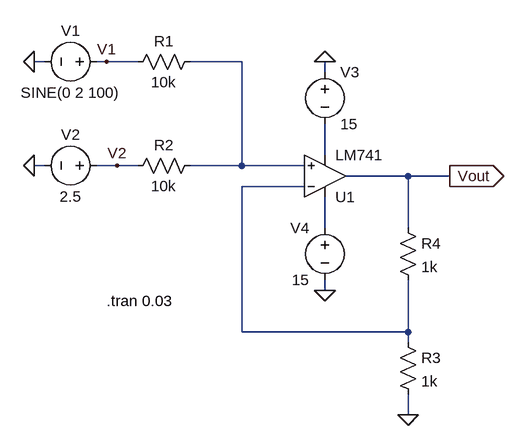
[diagram p0: schematic lab5_6b.asc]
lab5_6b.asc, the LTspice schematic file:
Version 4
SHEET 1 880 680
WIRE -224 -272 -240 -272
WIRE -128 -272 -144 -272
WIRE -80 -272 -128 -272
WIRE 80 -272 0 -272
WIRE 208 -256 208 -272
WIRE 208 -128 208 -176
WIRE -224 -112 -240 -112
WIRE -112 -112 -144 -112
WIRE -80 -112 -112 -112
WIRE 80 -112 80 -272
WIRE 80 -112 0 -112
WIRE 176 -112 80 -112
WIRE 336 -96 240 -96
WIRE 400 -96 336 -96
WIRE 176 -80 80 -80
WIRE 208 -16 208 -64
WIRE 336 -16 336 -96
WIRE 208 80 208 64
WIRE 80 144 80 -80
WIRE 336 144 336 64
WIRE 336 144 80 144
WIRE 336 160 336 144
WIRE 336 272 336 240
FLAG 208 80 0
FLAG 208 -272 0
FLAG -240 -272 0
FLAG -240 -112 0
FLAG 336 272 0
FLAG 400 -96 Vout
IOPIN 400 -96 Out
FLAG -128 -272 V1
FLAG -112 -112 V2
SYMBOL OpAmps\\LM741 208 -32 M180
SYMATTR InstName U1
SYMBOL res 16 -128 R90
WINDOW 0 0 56 VBottom 2
WINDOW 3 32 56 VTop 2
SYMATTR InstName R2
SYMATTR Value 10k
SYMBOL voltage -128 -272 R90
WINDOW 0 -32 56 VBottom 2
WINDOW 3 32 56 VTop 2
WINDOW 123 0 0 Left 0
WINDOW 39 -4 56 VBottom 2
SYMATTR InstName V1
SYMATTR Value SINE(0 2 100)
SYMBOL voltage -128 -112 R90
WINDOW 0 -32 56 VBottom 2
WINDOW 3 32 56 VTop 2
WINDOW 123 0 0 Left 0
WINDOW 39 0 0 Left 0
SYMATTR InstName V2
SYMATTR Value 2.5
SYMBOL voltage 208 -272 R0
WINDOW 123 0 0 Left 0
WINDOW 39 0 0 Left 0
SYMATTR InstName V3
SYMATTR Value 15
SYMBOL voltage 208 -32 M0
WINDOW 123 0 0 Left 0
WINDOW 39 0 0 Left 0
SYMATTR InstName V4
SYMATTR Value 15
SYMBOL res 320 -32 R0
SYMATTR InstName R4
SYMATTR Value 1k
SYMBOL res 320 144 R0
SYMATTR InstName R3
SYMATTR Value 1k
SYMBOL res 16 -288 R90
WINDOW 0 0 56 VBottom 2
WINDOW 3 32 56 VTop 2
SYMATTR InstName R1
SYMATTR Value 10k
TEXT -128 96 Left 2 !.tran 0.03

The netlist it stands for:
* lab5_6b.asc
XU1 N001 N003 N004 N002 Vout LM741  ; pins In+ In- V+ V- OUT
R2 N001 V2 10k
V1 V1 0 SINE(0 2 100)
V2 V2 0 2.5
V3 0 N002 15
V4 N004 0 15
R4 Vout N003 1k
R3 N003 0 1k
R1 N001 V1 10k
.tran 0.03
.lib LM741.lib
.backanno
.end